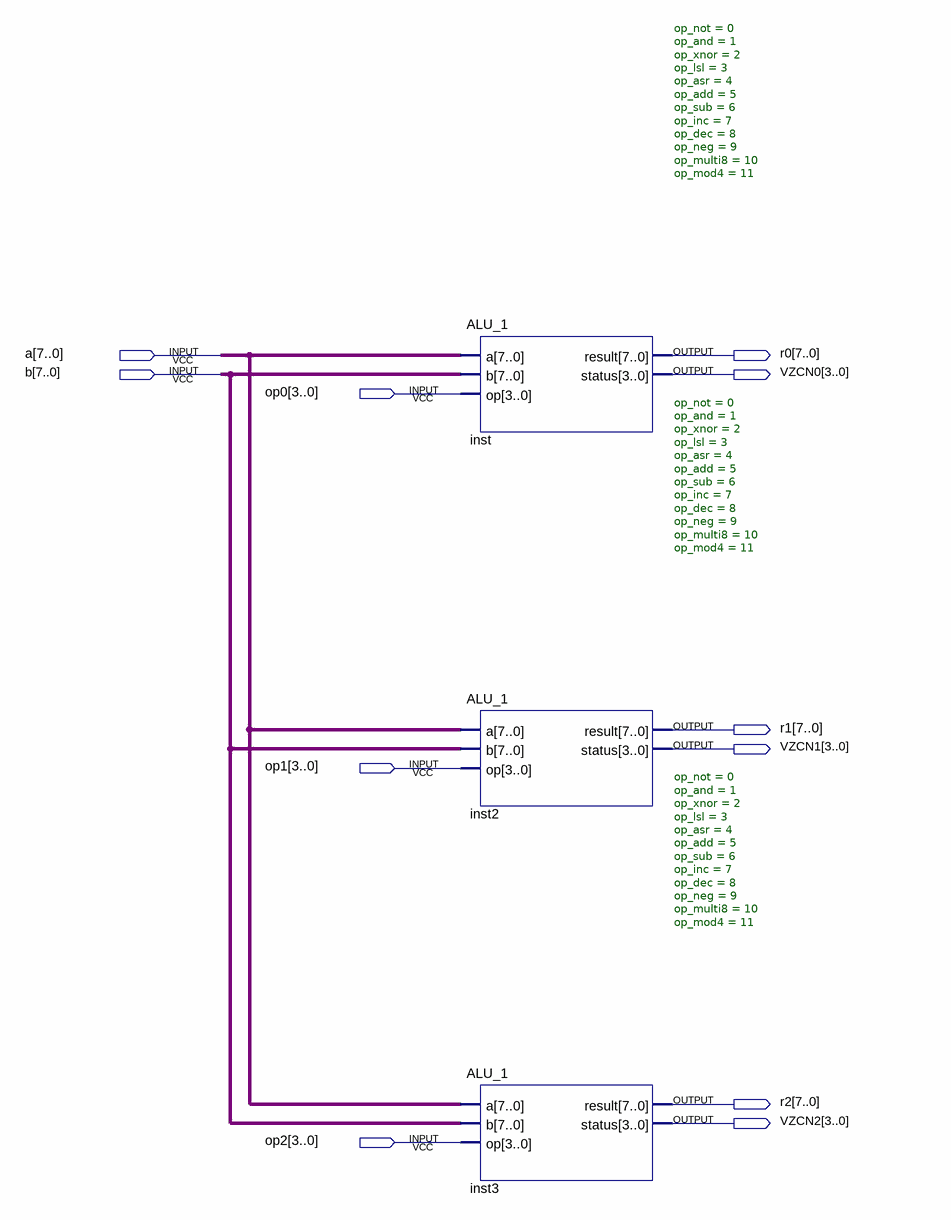
[diagram p0: schematic sheet]
// Quartus schematic alu.bdf as structural Verilog: 3 symbols, 11 pins
module alu (
  input  [7:0] a,
  input  [7:0] b,
  input  [3:0] op0,
  input  [3:0] op1,
  input  [3:0] op2,
  output [7:0] r0,
  output [3:0] VZCN0,
  output [7:0] r1,
  output [3:0] VZCN1,
  output [7:0] r2,
  output [3:0] VZCN2
);

  ALU_1 #(.op_not(0), .op_and(1), .op_xnor(2), .op_lsl(3), .op_asr(4), .op_add(5), .op_sub(6), .op_inc(7), .op_dec(8), .op_neg(9), .op_multi8(10), .op_mod4(11)) inst (
    .a(a), .b(b), .op(op0), .result(r0), .status(VZCN0));
  ALU_1 #(.op_not(0), .op_and(1), .op_xnor(2), .op_lsl(3), .op_asr(4), .op_add(5), .op_sub(6), .op_inc(7), .op_dec(8), .op_neg(9), .op_multi8(10), .op_mod4(11)) inst2 (
    .a(a), .b(b), .op(op1), .result(r1), .status(VZCN1));
  ALU_1 #(.op_not(0), .op_and(1), .op_xnor(2), .op_lsl(3), .op_asr(4), .op_add(5), .op_sub(6), .op_inc(7), .op_dec(8), .op_neg(9), .op_multi8(10), .op_mod4(11)) inst3 (
    .a(a), .b(b), .op(op2), .result(r2), .status(VZCN2));
endmodule
